# Altium schematic sheet Controller-Sheet.SchDoc
size A4; DocumentNumber: 4; SheetNumber: 4; SheetTotal: 5
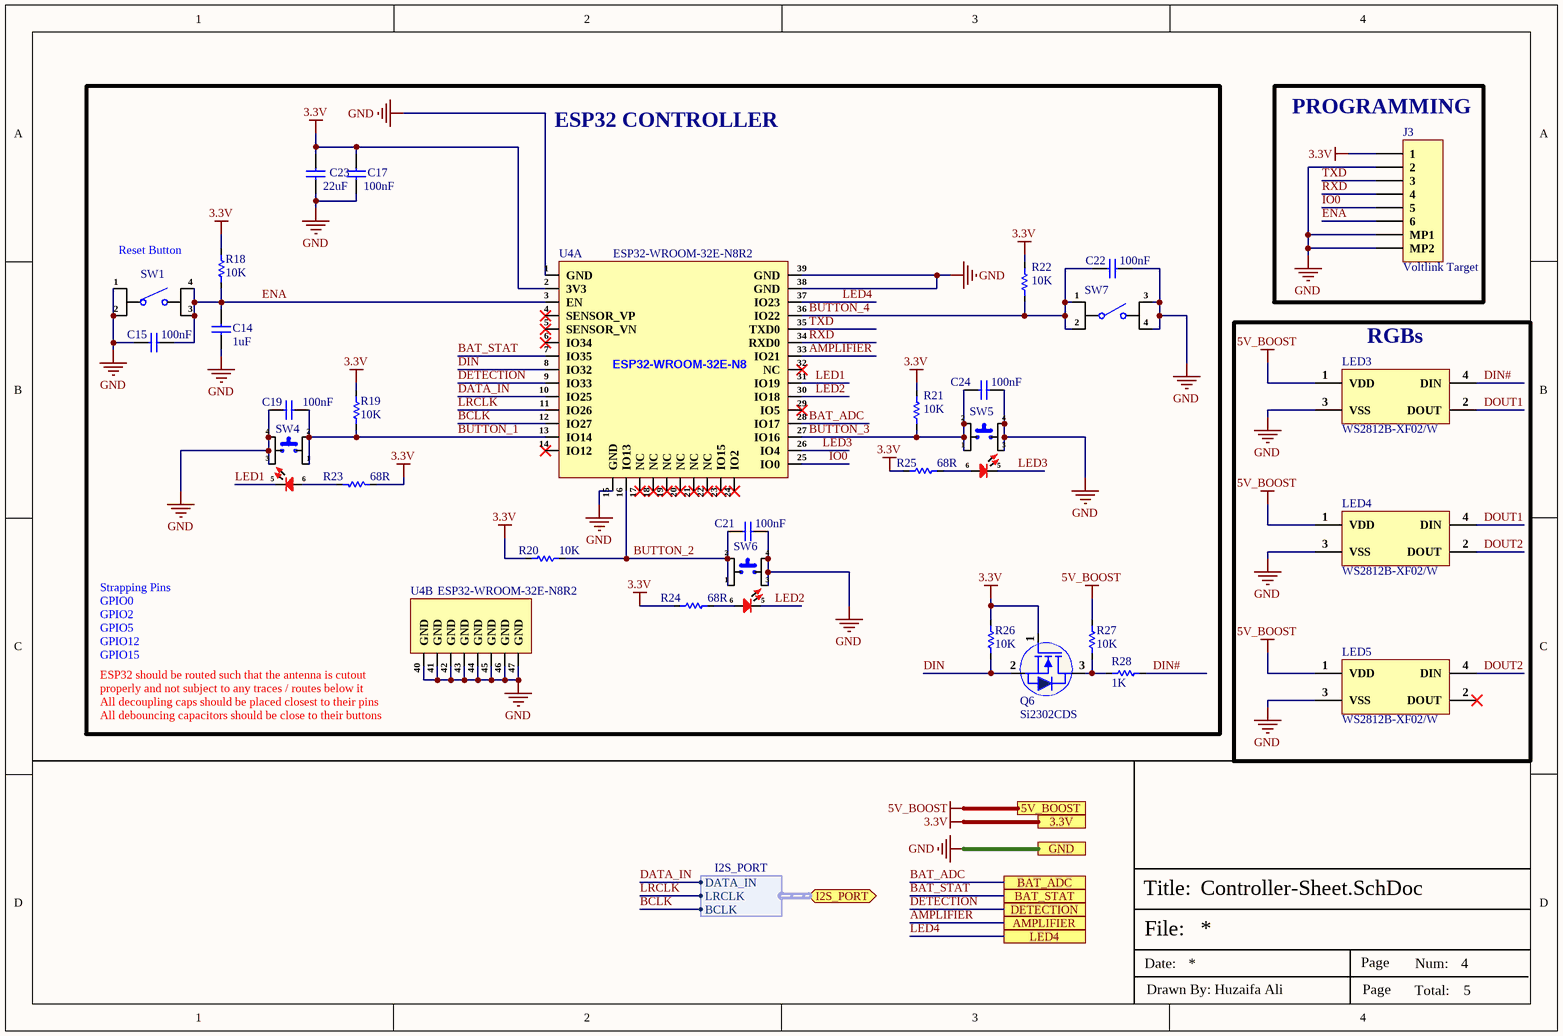
[diagram p0: Controller-Sheet.SchDoc]

## Parts
C14  1uF  [Cap-0603]
C15  100nF  [Cap-0402]
C17  100nF  [Cap-0402]
C19  100nF  [Cap-0402]
C21  100nF  [Cap-0402]
C22  100nF  [Cap-0402]
C23  22uF  [Cap-0603]
C24  100nF  [Cap-0402]
J3  Voltlink Target  [Voltlink Target]
LED3  WS2812B-XF02/W  [WS2812B-XF02/W]
LED4  WS2812B-XF02/W  [WS2812B-XF02/W]
LED5  WS2812B-XF02/W  [WS2812B-XF02/W]
Q6  Si2302CDS  [Sot-23]
R18  10K  [Res-0603]
R19  10K  [Res-0603]
R20  10K  [Res-0603]
R21  10K  [Res-0603]
R22  10K  [Res-0603]
R23  68R  [Res-0402]
R24  68R  [Res-0402]
R25  68R  [Res-0402]
R26  10K  [Res-0402]
R27  10K  [Res-0402]
R28  1K  [Res-0603]
SW1  TS-1109S-C-B  [TS-1109S-C-B]  (value not drawn)
SW4  TL1260GQRBLK  [TL1260GQRBLK]  (value not drawn)
SW5  TL1260GQRBLK  [TL1260GQRBLK]  (value not drawn)
SW6  TL1260GQRBLK  [TL1260GQRBLK]  (value not drawn)
SW7  TS-1109S-B-J  [TS-1109S-B-J_]  (value not drawn)
U4  ESP32-WROOM-32E-N8R2  [38-SMD Module]  (parts A,B of 2)

## Blocks framed on the sheet
ESP32 CONTROLLER: C14 C15 C17 C19 C21-C24 Q6 R18-R28 SW1 SW4-SW7 U4
PROGRAMMING: J3
RGBs: LED3-LED5

## Ports
3.3V, 5V_BOOST, AMPLIFIER, BAT_ADC, BAT_STAT, DETECTION, GND, I2S_PORT (bidir, harness I2S_PORT), LED4

## Harnesses
I2S_PORT: DATA_IN, LRCLK, BCLK

## Nets
3.3V: C17.2 C23.2 J3.1 Q6.1(G) R18.2 R19.2 R20.2 R21.2 R22.2 R23.2 R24.2 R25.2 R26.1 U4.2(3V3) ; port 3.3V
5V_BOOST: LED3.1(VDD) LED4.1(VDD) LED5.1(VDD) R27.1 ; port 5V_BOOST
GND: C14.1 C15.1 C17.1 C19.2 C21.2 C22.2 C23.1 C24.2 J3.2 J3.MP1 J3.MP2 LED3.3(VSS) LED4.3(VSS) LED5.3(VSS) SW1.1 SW1.2 SW4.3 SW4.4 SW5.3 SW5.4 SW6.3 SW6.4 SW7.3 SW7.4 U4.1(GND) U4.15(GND) U4.38(GND) U4.39(GND) U4.40(GND) U4.41(GND) U4.42(GND) U4.43(GND) U4.44(GND) U4.45(GND) U4.46(GND) U4.47(GND) ; port GND
AMPLIFIER: U4.33(IO21) ; port AMPLIFIER
BAT_ADC: U4.28(IO17) ; port BAT_ADC
BAT_STAT: U4.7(IO35) ; port BAT_STAT
BCLK: U4.12(IO27) ; port I2S_PORT.BCLK
BUTTON_1: C19.1 R19.1 SW4.1 SW4.2 U4.13(IO14)
BUTTON_2: C21.1 R20.1 SW6.1 SW6.2 U4.16(IO13)
BUTTON_3: C24.1 R21.1 SW5.1 SW5.2 U4.27(IO16)
BUTTON_4: C22.1 R22.1 SW7.1 SW7.2 U4.36(IO22)
DATA_IN: U4.10(IO25) ; port I2S_PORT.DATA_IN
DETECTION: U4.9(IO33) ; port DETECTION
DIN: Q6.2(S) R26.2 U4.8(IO32)
DIN#: LED3.4(DIN) R28.2
DOUT1: LED3.2(DOUT) LED4.4(DIN)
DOUT2: LED4.2(DOUT) LED5.4(DIN)
ENA: C14.2 C15.2 J3.6 R18.1 SW1.3 SW1.4 U4.3(EN)
IO0: J3.5 U4.25(IO0)
LED1: SW4.5(-) U4.31(IO19)
LED2: SW6.5(-) U4.30(IO18)
LED3: SW5.5(-) U4.26(IO4)
LED4: U4.37(IO23) ; port LED4
LRCLK: U4.11(IO26) ; port I2S_PORT.LRCLK
RXD: J3.4 U4.34(RXD0)
TXD: J3.3 U4.35(TXD0)
NetQ6_3: Q6.3(D) R27.2 R28.1
NetR23_1: R23.1 SW4.6(+)
NetR24_1: R24.1 SW6.6(+)
NetR25_1: R25.1 SW5.6(+)

Not connected (* = marked no-connect by the designer): LED5 2(DOUT)*; U4 4(SENSOR_VP)* 5(SENSOR_VN)* 6(IO34)* 14(IO12)* 17(NC)* 18(NC)* 19(NC)* 20(NC)* 21(NC)* 22(NC)* 23(IO15)* 24(IO2)* 29(IO5)* 32(NC)*

## Notes on the sheet
- Reset Button
- Strapping Pins
  GPIO0
  GPIO2
  GPIO5
  GPIO12
  GPIO15
- ESP32 should be routed such that the antenna is cutout properly and not subject to any traces / routes below it
- All decoupling caps should be placed closest to their pins
- All debouncing capacitors should be close to their buttons
- File:
- Title:
- Date:
- Page
- Num:
- Total:
- Drawn By: Huzaifa Ali
- (in symbol ESP32-WROOM-32E-N8R2, part A) ESP32-WROOM-32E-N8

## Library data of the parts
C14 = CC0603KRX5R8BB105: CAP CER 1UF 25V X5R 0603; Manufacturer: Yageo; Tolerance: 10%; Supplier 1: Digi-Key; Manufacturer Part Number: CC0603KRX5R8BB105; RoHS: Yes; Category: Ceramic Capacitors; Stock 1: 919939; Pricing 1: 1=0.12000, 10=0.08400, 50=0.04760, 100=0.03940, 500=0.02764, 1000=0.02288 (USD); Mount: Surface Mount; Case/Package: 0603; Number of Pins: 2; Case Code (Metric): 1608; Case Code (Imperial): 0603; Min Operating Temperature: -55°C; Max Operating Temperature: 85°C; Capacitance: 1uF; Dielectric: X5R; Package Quantity: 1; Voltage Rating: 25V; Packaging: Tape and Reel; Termination: SMD/SMT; Voltage Rating (DC): 25V; Series: CC; Construction: Flat; Length: 1.6mm; Width: 0.031inch; Height: 0.8mm; Thickness: 0.035inch; Depth: 0.8mm; Radiation Hardening: No; REACH SVHC: No SVHC; Lead Free: Lead Free; Halogen Free: Halogen Free; RoHS Compliant: Yes; ComponentLink1URL: https://datasheet.ciiva.com/176/mlccorderingcode-176785.pdf?src-supplier=Digi-Key; ComponentLink1Description: https://datasheet.ciiva.com/176/mlccorderingcode-176785.pdf?src-supplier=Digi-Key; ComponentLink2URL: https://datasheet.ciiva.com/176/mlccorderingcode-176786.pdf?src-supplier=Digi-Key; ComponentLink2Description: https://datasheet.ciiva.com/176/mlccorderingcode-176786.pdf?src-supplier=Digi-Key; ComponentLink3URL: https://datasheet.ciiva.com/176/mlccorderingcode-176787.pdf?src-supplier=Digi-Key; ComponentLink3Description: https://datasheet.ciiva.com/176/mlccorderingcode-176787.pdf?src-supplier=Digi-Key; ComponentLink4URL: https://datasheet.ciiva.com/17436/upy-gphc-x5r-4v-to-50v-12-17436952.pdf?src-supplier=Avnet+Europe; ComponentLink4Description: https://datasheet.ciiva.com/17436/upy-gphc-x5r-4v-to-50v-12-17436952.pdf?src-supplier=Avnet+Europe; ComponentLink5URL: https://datasheet.ciiva.com/7978/1525783-7978171.pdf?src-supplier=Element14; ComponentLink5Description: https://datasheet.ciiva.com/7978/1525783-7978171.pdf?src-supplier=Element14; ComponentLink6URL: https://datasheet.ciiva.com/11586/upy-gphc-x5r-4v-to-50v-12-11586318.pdf?src-supplier=Avnet; ComponentLink6Description: https://datasheet.ciiva.com/11586/upy-gphc-x5r-4v-to-50v-12-11586318.pdf?src-supplier=Avnet; Supplier Part Number 1: 311-1445-1-ND; LCSC Part Number: C14664
C15 C17 C19 C21 C22 C24 = CC0402KRX5R8BB104: CAP CER 0.1UF 25V X5R 0402; Manufacturer: Yageo; Tolerance: 10%; Item Type: Capacitor; Supplier 1: Digi-Key; Manufacturer Part Number: CC0402KRX5R8BB104; RoHS: Yes; Category: Ceramic Capacitors; Stock 1: 4598218; Pricing 1: 1=0.10000, 10=0.03800, 50=0.02100, 100=0.01710, 500=0.01224, 1000=0.00961, 2500=0.00874, 5000=0.00804 (USD); Mount: Surface Mount; Case/Package: 0402; Case Code (Metric): 1005; Case Code (Imperial): 0402; Min Operating Temperature: -55°C; Max Operating Temperature: 85°C; Voltage Rating: 25V; Packaging: Tape and Reel; Capacitance: 100nF; Voltage Rating (DC): 25V; Dielectric: X5R; Resistor Type: Ceramic; Series: CC; Length: 0.039inch; Width: 0.02inch; Thickness: 0.022inch; Depth: 0.5mm; Lead Free: Lead Free; Halogen Free: Halogen Free; RoHS Compliant: Yes; ComponentLink1URL: http://www.mouser.com/ds/2/447/UPY-GPHC_X5R_4V-to-50V_25-1131599.pdf?src-supplier=Mouser; ComponentLink1Description: http://www.mouser.com/ds/2/447/UPY-GPHC_X5R_4V-to-50V_25-1131599.pdf?src-supplier=Mouser; ComponentLink2URL: http://www.yageo.com/documents/recent/UPY-GPHC_X5R_4V-to-50V-16.pdf?src-supplier=Future+Electronics; ComponentLink2Description: http://www.yageo.com/documents/recent/UPY-GPHC_X5R_4V-to-50V-16.pdf?src-supplier=Future+Electronics; ComponentLink3URL: http://www.yageo.com/documents/recent/UPY-GPHC_X5R_4V-to-50V_25.pdf?src-supplier=Digi-Key; ComponentLink3Description: http://www.yageo.com/documents/recent/UPY-GPHC_X5R_4V-to-50V_25.pdf?src-supplier=Digi-Key; Supplier Part Number 1: 311-1697-1-ND; LCSC Part Number: C106256
C23 = CC0603MRX5R6BB226: CAP CER 22UF 10V X5R 0603; Manufacturer: Yageo; Tolerance: 20%; Supplier 1: Digi-Key; Manufacturer Part Number: CC0603MRX5R6BB226; RoHS: Yes; Category: Ceramic Capacitors; Stock 1: 19628; Pricing 1: 1=0.68000, 10=0.48000, 50=0.36300, 100=0.31610, 500=0.23416, 1000=0.19903 (USD); Mount: Surface Mount; Case/Package: 0603; Case Code (Metric): 1608; Case Code (Imperial): 0603; Weight: 7.1E-05oz; Min Operating Temperature: -55°C; Max Operating Temperature: 85°C; Packaging: Tape and Reel; Capacitance: 22uF; Voltage Rating: 10V; Dielectric: X5R; Termination: SMD/SMT; Voltage Rating (DC): 10V; Package Quantity: 4000; Length: 0.063inch; Width: 0.8mm; Height: 0.8mm; Thickness: 0.035inch; Lead Free: Lead Free; Halogen Free: Halogen Free; RoHS Compliant: Yes; ComponentLink1URL: http://www.mouser.com/ds/2/447/Yageo_UPY-GP_NP0_16V-to-50V_9-358835.pdf?src-supplier=Mouser; ComponentLink1Description: http://www.mouser.com/ds/2/447/Yageo_UPY-GP_NP0_16V-to-50V_9-358835.pdf?src-supplier=Mouser; ComponentLink2URL: http://www.yageo.com/documents/recent/UPY-GPHC_X5R_4V-to-50V_25.pdf?src-supplier=Digi-Key; ComponentLink2Description: http://www.yageo.com/documents/recent/UPY-GPHC_X5R_4V-to-50V_25.pdf?src-supplier=Digi-Key; Supplier Part Number 1: 311-1819-1-ND; LCSC Part Number: C109447
J3 = C145963: 1x6P SH 1 1mm 6 SMD,P=1mm Wire To Board / Wire To Wire Connector ROHS; Manufacturer: BOOMELE; Manufacturer Part Number: C145963; Package: SMD,P=1mm; LCSC Part Number: C145963; Item Type: Connector; ComponentLink1Description: LCSC; ComponentLink1URL: https://www.lcsc.com/product-detail/Wire-To-Board-Wire-To-Wire-Connector_BOOMELE-Boom-Precision-Elec-C145963_C145963.html
LED3-LED5 = WS2812B-XF02/W: SMD5050 Light Emitting Diodes (LED) ROHS; Manufacturer: Worldsemi; Item Type: RGB LED; Manufacturer Part Number: WS2812B-XF02/W; Package: SMD5050; LCSC Part Number: C4154882; ComponentLink1Description: LCSC; ComponentLink1URL: https://www.lcsc.com/product-detail/Light-Emitting-Diodes-LED_Worldsemi-WS2812B-XF02-W_C4154882.html
Q6 = Si2302CDS: N-CHANNEL 20-V (D-S) MOSFET; Manufacturer: TECH PUBLIC; ComponentLink1Description: LCSC; ComponentLink1URL: https://www.lcsc.com/product-detail/MOSFETs_TECH-PUBLIC-SI2302CDS_C5310968.html; Manufacturer Part Number: SI2302CDS; Package: SOT-23; LCSC Part Number: C5310968; Item Type: Mosfet
R18-R22 = RC0603FR-0710KL: RES SMD 10K Ohm 1% 1/10W 0603; Manufacturer: Yageo; Resistance: 10kR; Temperature Coefficient: 100ppm/°C; Voltage Rating (DC): 50V; Power Rating: 100mW; Voltage Rating: 75V; Item Type: Resistor; Supplier 1: Digi-Key; Manufacturer Part Number: RC0603FR-0710KL; RoHS: Yes; Category: Chip SMD Resistors; Stock 1: 25249139; Pricing 1: 1=0.10000, 10=0.02400, 100=0.00970, 1000=0.00436, 2500=0.00378 (USD); Case/Package: 0603; Number of Pins: 2; Case Code (Imperial): 0603; Case Code (Metric): 1608; Weight: 7.1E-05oz; Size Code: 0603; Min Operating Temperature: -55°C; Max Operating Temperature: 155°C; Tolerance: 1%; Resistor Type: Thick Film; Packaging: Tape and Reel; Termination: SMD/SMT; Features: Moisture Resistant; Series: RC; Max Power Dissipation: 100mW; Number of Terminations: 2; Resistance Tolerance: 1%; Construction: Rectangular; Length: 1.6mm; Width: 0.8mm; Height: 0.45mm; Depth: 0.8mm; Lead Pitch: 0.3mm; REACH SVHC: Unknown; Lead Free: Lead Free; Military Standard: Not; RoHS Compliant: Yes; ComponentLink1URL: https://datasheet.ciiva.com/7660/38590-7660789.pdf?src-supplier=Element14; ComponentLink1Description: https://datasheet.ciiva.com/7660/38590-7660789.pdf?src-supplier=Element14; ComponentLink2URL: https://datasheet.ciiva.com/7983/443971-7983596.pdf?src-supplier=Element14; ComponentLink2Description: https://datasheet.ciiva.com/7983/443971-7983596.pdf?src-supplier=Element14; ComponentLink3URL: https://datasheet.ciiva.com/22747/443971-22747519.pdf?src-supplier=Element14; ComponentLink3Description: https://datasheet.ciiva.com/22747/443971-22747519.pdf?src-supplier=Element14; ComponentLink4URL: https://datasheet.ciiva.com/46440/1868787-46440891.pdf?src-supplier=Element14; ComponentLink4Description: https://datasheet.ciiva.com/46440/1868787-46440891.pdf?src-supplier=Element14; ComponentLink5URL: https://datasheet.ciiva.com/7746/1738695-7746239.pdf?src-supplier=Element14; ComponentLink5Description: https://datasheet.ciiva.com/7746/1738695-7746239.pdf?src-supplier=Element14; ComponentLink6URL: https://datasheet.ciiva.com/15189/getdatasheetpartid-409289-15189591.pdf?src-supplier=Verical; ComponentLink6Description: https://datasheet.ciiva.com/15189/getdatasheetpartid-409289-15189591.pdf?src-supplier=Verical; Supplier Part Number 1: 311-10.0KHRCT-ND; LCSC Part Number: C98220
R23-R25 = ERA2AEB680X: RES SMD 68 OHM 0.1% 1/16W 0402; Manufacturer: Panasonic; Manufacturer Part Number: ERA-2AEB680X; Temperature Coefficient: 25ppm/°C; Power Rating: 63mW; Voltage Rating: 25V; Supplier 1: Arrow Electronics; RoHS: Yes; Category: Chip SMD Resistors; Stock 1: 1; Pricing 1: 1=0.36470, 10000=0.05710 (USD); Mount: Surface Mount; Case/Package: 0402; Number of Pins: 2; Contact Plating: Tin; Case Code (Metric): 1005; Case Code (Imperial): 0402; Min Operating Temperature: -55°C; Max Operating Temperature: 155°C; Resistance: 68R; Tolerance: 0.1%; Resistor Type: Thin Film,Metal Film; Packaging: Tape and Reel; Package Quantity: 10000; Number of Terminations: 2; Max Power Dissipation: 63mW; Voltage Rating (DC): 25V; Length: 1mm; Width: 0.02inch; Height: 0.35mm; Depth: 0.5mm; Radiation Hardening: No; REACH SVHC: No SVHC; Military Standard: Not; Lead Free: Lead Free; ComponentLink1URL: https://datasheet.ciiva.com/5838/328837-5838032.pdf?src-supplier=Farnell; ComponentLink1Description: https://datasheet.ciiva.com/5838/328837-5838032.pdf?src-supplier=Farnell; ComponentLink2URL: https://datasheet.ciiva.com/11812/0900766b80beefcc-11812130.pdf?src-supplier=RSComponents; ComponentLink2Description: https://datasheet.ciiva.com/11812/0900766b80beefcc-11812130.pdf?src-supplier=RSComponents; ComponentLink3URL: https://datasheet.ciiva.com/7657/328837-7657366.pdf?src-supplier=Element14; ComponentLink3Description: https://datasheet.ciiva.com/7657/328837-7657366.pdf?src-supplier=Element14; ComponentLink4URL: https://datasheet.ciiva.com/7944/328837-7944487.pdf?src-supplier=Element14; ComponentLink4Description: https://datasheet.ciiva.com/7944/328837-7944487.pdf?src-supplier=Element14; ComponentLink5URL: https://datasheet.ciiva.com/17208/aoa0000ce26-17208797.pdf?src-supplier=Avnet+Europe; ComponentLink5Description: https://datasheet.ciiva.com/17208/aoa0000ce26-17208797.pdf?src-supplier=Avnet+Europe; Supplier Part Number 1: ERA-2AEB680X; LCSC Part Number: C445573
R26 R27 = RC0402FR-0710KL: RES 10K OHM 1% 1/16W 0402; Manufacturer: Yageo; Resistance: 10kR; Voltage Rating (DC): 50V; Temperature Coefficient: 100ppm/°C; Power Rating: 62.5mW; Max Power Dissipation: 63mW; Item Type: Resistor; Supplier 1: Mouser; Manufacturer Part Number: RC0402FR-0710KL; RoHS: Yes; Category: Chip SMD Resistors; Stock 1: 18648329; Pricing 1: 1=0.10000, 10=0.01400, 50=0.01400, 100=0.00500, 1000=0.00300, 10000=0.00200 (USD); Case/Package: 0402; Number of Pins: 2; Case Code (Imperial): 0402; Case Code (Metric): 1005; Min Operating Temperature: -55°C; Max Operating Temperature: 155°C; Resistor Type: Thick Film; Tolerance: 1%; Packaging: Tape and Reel; Voltage Rating: 50V; Termination: SMD/SMT; Working Voltage: 50V; Number of Terminations: 2; Features: Moisture Resistant; Series: RC; Resistance Tolerance: 1%; Construction: Rectangular; Length: 1mm; Width: 0.5mm; Height: 0.32mm; Depth: 0.5mm; Lead Pitch: 0.2mm; REACH SVHC: No SVHC; Lead Free: Lead Free; RoHS Compliant: Yes; Military Standard: Not; ComponentLink1URL: https://datasheet.ciiva.com/7660/38568-7660787.pdf?src-supplier=Element14; ComponentLink1Description: https://datasheet.ciiva.com/7660/38568-7660787.pdf?src-supplier=Element14; ComponentLink2URL: https://datasheet.ciiva.com/7849/1686128-7849814.pdf?src-supplier=Element14; ComponentLink2Description: https://datasheet.ciiva.com/7849/1686128-7849814.pdf?src-supplier=Element14; ComponentLink3URL: https://datasheet.ciiva.com/7983/1018594-7983486.pdf?src-supplier=Element14; ComponentLink3Description: https://datasheet.ciiva.com/7983/1018594-7983486.pdf?src-supplier=Element14; ComponentLink4URL: https://datasheet.ciiva.com/22747/1018594-22747512.pdf?src-supplier=Element14; ComponentLink4Description: https://datasheet.ciiva.com/22747/1018594-22747512.pdf?src-supplier=Element14; ComponentLink5URL: https://datasheet.ciiva.com/12667/pyu-rc0402-51-rohs-l-6-r-12667067.pdf?src-supplier=Mouser; ComponentLink5Description: https://datasheet.ciiva.com/12667/pyu-rc0402-51-rohs-l-6-r-12667067.pdf?src-supplier=Mouser; ComponentLink6URL: https://datasheet.ciiva.com/7849/1784430-7849813.pdf?src-supplier=Element14; ComponentLink6Description: https://datasheet.ciiva.com/7849/1784430-7849813.pdf?src-supplier=Element14; ComponentLink7URL: https://datasheet.ciiva.com/7849/1784430-7849815.pdf?src-supplier=Element14; ComponentLink7Description: https://datasheet.ciiva.com/7849/1784430-7849815.pdf?src-supplier=Element14; Supplier Part Number 1: 603-RC0402FR-0710KL; LCSC Part Number: C60490
R28 = RC0603FR-071KL: RES SMD 1K OHM 1% 1/10W 0603; Manufacturer: Yageo; Resistance: 1kR; Temperature Coefficient: 100ppm/°C; Power Rating: 100mW; Voltage Rating: 50V; Item type: Resistor; ComponentLink1URL: https://www.verical.com/server-webapp/html/getDatasheet?partID=409289&src-supplier=Verical; ComponentLink1Description: https://www.verical.com/server-webapp/html/getDatasheet?partID=409289&src-supplier=Verical; Supplier 1: Digi-Key; Manufacturer Part Number: RC0603FR-071KL; Stock 1: 21472395; Pricing 1: 1=0.1, 10=0.023, 100=0.0094, 1000=0.0042, 2500=0.0037 (USD); Case/Package: 0603; Contact Plating: Tin,Matte; Case Code (Imperial): 0603; Case Code (Metric): 1608; Min Operating Temperature: -55°C; Max Operating Temperature: 155°C; Tolerance: 1%; Composition: Thick Film; Packaging: Tape and Reel; Termination: SMD/SMT; Military Standard: Not; Length: 1.6mm; Height: 0.45mm; Depth: 0.8mm; Radiation Hardening: No; REACH SVHC: No SVHC; Lead Free: Lead Free; ComponentLink2URL: http://documents.rs-components.com/techlib://itc_doclist_GB.htm?stockno=5048928&src-supplier=RSComponents; ComponentLink2Description: http://documents.rs-components.com/techlib://itc_doclist_GB.htm?stockno=5048928&src-supplier=RSComponents; ComponentLink3URL: http://www.yageo.com/documents/recent/PYu-RC0603_51_RoHS_L_4.pdf?src-supplier=Avnet+Europe; ComponentLink3Description: http://www.yageo.com/documents/recent/PYu-RC0603_51_RoHS_L_4.pdf?src-supplier=Avnet+Europe; ComponentLink4URL: http://www.farnell.com/datasheets/2167052.pdf?src-supplier=Element14; ComponentLink4Description: http://www.farnell.com/datasheets/2167052.pdf?src-supplier=Element14; ComponentLink5URL: http://www.farnell.com/datasheets/1868787.pdf?src-supplier=Element14; ComponentLink5Description: http://www.farnell.com/datasheets/1868787.pdf?src-supplier=Element14; ComponentLink6URL: http://www.yageo.com/documents/recent/PYu-RC_Group_51_RoHS_L_2.pdf?src-supplier=Avnet; ComponentLink6Description: http://www.yageo.com/documents/recent/PYu-RC_Group_51_RoHS_L_2.pdf?src-supplier=Avnet; ComponentLink7URL: https://www.verical.com/server-webapp/html/getDatasheet?partID=404327&src-supplier=Verical; ComponentLink7Description: https://www.verical.com/server-webapp/html/getDatasheet?partID=404327&src-supplier=Verical; ComponentLink8URL: http://www.farnell.com/datasheets/443971.pdf?src-supplier=Element14; ComponentLink8Description: http://www.farnell.com/datasheets/443971.pdf?src-supplier=Element14; Supplier Part Number 1: 311-1.00KHRDKR-ND; LCSC Part Number: C22548
SW1 = TS-1109S-C-B: No NO 50mA 4.5mm 100000 260gf 12V -30℃~+85℃ 4.5mm 4.3mm Black Round Button Brick nogging SPST SMD Tactile Switches ROHS; Manufacturer: XKB Connectivity; Item Type: Switch; Manufacturer Part Number: TS-1109S-C-B; Package: Custom; LCSC Part Number: C381037; ComponentLink1Description: LCSC; ComponentLink1URL: https://www.lcsc.com/product-detail/Tactile-Switches_XKB-Connectivity-TS-1109S-C-B_C381037.html
SW4-SW6 = TL1260GQRBLK: SWITCH TACTILE SPST-NO 0.05A 12V; Manufacturer: E-Switch; Mechanical Life: 50000Cycles; Actuator Material: PBT,Polybutylene; Illumination Type: LED,Illuminated; Operating Force: 160gf; Throw Configuration: SPST; Switch Travel: 0.2mm; Switch Function: Off-Mom; Current Rating: 50mA; Illumination Color: Green; Item Type: Tactile Switch; Supplier 1: Digi-Key; Manufacturer Part Number: TL1260GQRBLK; RoHS: Yes; Category: Tactile Switches; Stock 1: 1154; Pricing 1: 1=3.53, 10=3.387, 25=3.0924, 100=2.6801, 250=2.42976, 500=2.25304, 1000=2.09106, 2500=1.89963, 5000=1.8225 (USD); Mounting Technology: Through Hole; Min Operating Temperature: -20°C; Max Operating Temperature: 70°C; Packaging: Bulk; Package Quantity: 1; Termination: PC Pin; Series: TL1260; Voltage Rating (DC): 12V; RoHS Compliant: Yes; Lead Free: Lead Free; ComponentLink1URL: https://datasheet.ciiva.com/2902/b200003h-2902974.pdf?src-supplier=Digi-Key; ComponentLink1Description: https://datasheet.ciiva.com/2902/b200003h-2902974.pdf?src-supplier=Digi-Key; Supplier Part Number 1: EG6023-ND
SW7 = TS-1109S-B-J: No NO 50mA 4.5mm 100000 160gf 12V -30℃~+85℃ 4.5mm 8mm Black Round Button Brick nogging SPST SMD Tactile Switches ROHS; Manufacturer: XKB Connectivity; Item Type: Switch; Manufacturer Part Number: TS-1109S-B-J; Package: SMD; LCSC Part Number: C480323; ComponentLink1Description: LCSC; ComponentLink1URL: https://www.lcsc.com/product-detail/span-style-background-color-ff0-Tactile-span-Switches_XKB-Connectivity-TS-1109S-B-J_C480323.html
U4 = ESP32-WROOM-32E-N8R2: RF TXRX MODULE BT PCB TRACE SMD; Manufacturer: Espressif Systems; Supplier: Digikey; Supplier Part Number: 1965-ESP32-WROOM-32E-N8R2DKR-ND; Manufacturer Part Number: ESP32-WROOM-32E-N8R2; RoHS: No; Category: Uncategorized; Pricing: 1=2.88 (USD); LCSC Part Number: C5361945; Item Type: Module